# Altium project CtrlBox.PrjPcb
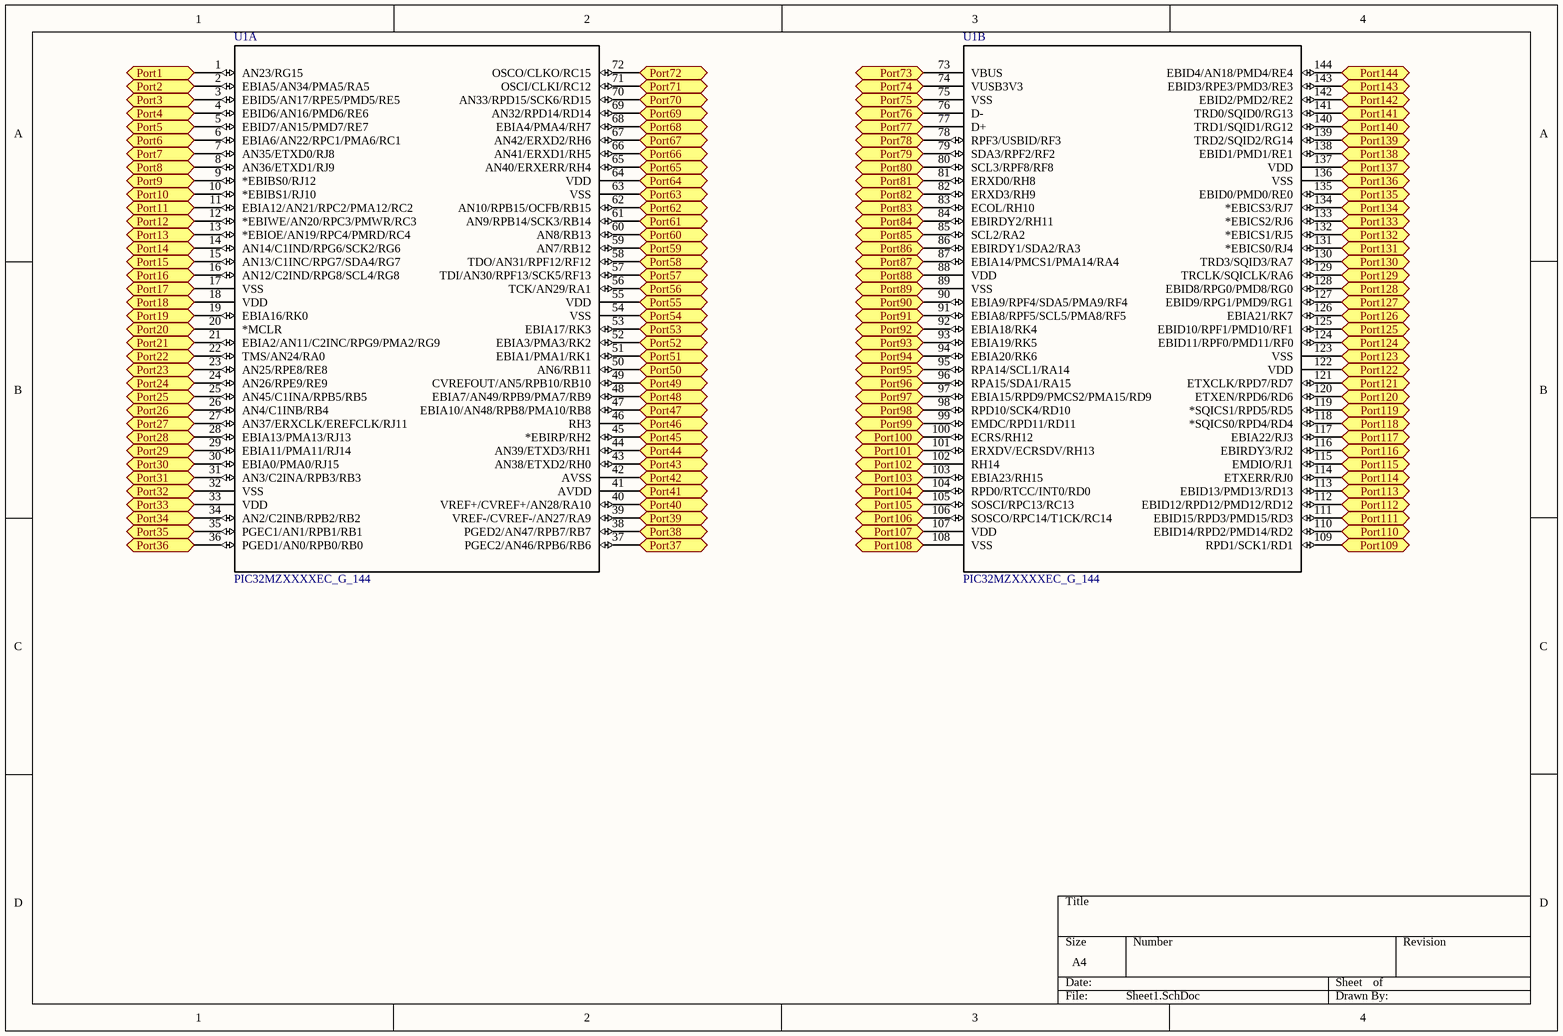
[diagram p0: Sheet1.SchDoc]
2 sheets, 31 parts. Net scope: flat (ports and power ports of the same name join across sheets).
Board file: PCB1.PcbDoc
Sheets:
  Sheet1.SchDoc
  Sheet2.SchDoc

## Sheet Sheet1.SchDoc
size A4

### Parts
U1  PIC32MZXXXXEC_G_144  [TQFP144_16X16MC]  (parts A,B of 2)

### Ports
Port1, Port2, Port3, Port4, Port5, Port6, Port7, Port8, Port9, Port10, Port11, Port12, Port13, Port14, Port15, Port16, Port17, Port18, Port19, Port20, Port21, Port22, Port23, Port24, Port25, Port26, Port27, Port28, Port29, Port30, Port31, Port32, Port33, Port34, Port35, Port36, Port37, Port38, Port39, Port40, Port41, Port42, Port43, Port44, Port45, Port46, Port47, Port48, Port49, Port50, Port51, Port52, Port53, Port54, Port55, Port56, Port57, Port58, Port59, Port60, Port61, Port62, Port63, Port64, Port65, Port66, Port67, Port68, Port69, Port70, Port71, Port72, Port73, Port74, Port75, Port76, Port77, Port78, Port79, Port80, Port81, Port82, Port83, Port84, Port85, Port86, Port87, Port88, Port89, Port90, Port91, Port92, Port93, Port94, Port95, Port96, Port97, Port98, Port99, Port100, Port101, Port102, Port103, Port104, Port105, Port106, Port107, Port108, Port109, Port110, Port111, Port112, Port113, Port114, Port115, Port116, Port117, Port118, Port119, Port120, Port121, Port122, Port123, Port124, Port125, Port126, Port127, Port128, Port129, Port130, Port131, Port132, Port133, Port134, Port135, Port136, Port137, Port138, Port139, Port140, Port141, Port142, Port143, Port144

### Nets
GND: U1.17(VSS) U1.32(VSS) U1.42(AVSS) U1.54(VSS) U1.63(VSS) U1.89(VSS) U1.108(VSS) U1.123(VSS) U1.136(VSS) ; port Port17, port Port32, port Port42, port Port54, port Port63, port Port89, port Port108, port Port123, port Port136
VCC: U1.18(VDD) U1.33(VDD) U1.41(AVDD) U1.55(VDD) U1.64(VDD) U1.88(VDD) U1.107(VDD) U1.122(VDD) U1.137(VDD) ; port Port18, port Port33, port Port41, port Port55, port Port64, port Port88, port Port107, port Port122, port Port137
NetP1_1: U1.1(AN23/RG15) ; port Port1
NetP1_2: U1.2(EBIA5/AN34/PMA5/RA5) ; port Port2
NetP1_3: U1.3(EBID5/AN17/RPE5/PMD5/RE5) ; port Port3
NetP1_4: U1.4(EBID6/AN16/PMD6/RE6) ; port Port4
NetP1_5: U1.5(EBID7/AN15/PMD7/RE7) ; port Port5
NetP1_6: U1.6(EBIA6/AN22/RPC1/PMA6/RC1) ; port Port6
NetP1_7: U1.7(AN35/ETXD0/RJ8) ; port Port7
NetP1_8: U1.8(AN36/ETXD1/RJ9) ; port Port8
NetP1_9: U1.9(*EBIBS0/RJ12) ; port Port9
NetP1_10: U1.10(*EBIBS1/RJ10) ; port Port10
NetP1_11: U1.11(EBIA12/AN21/RPC2/PMA12/RC2) ; port Port11
NetP1_12: U1.12(*EBIWE/AN20/RPC3/PMWR/RC3) ; port Port12
NetP1_13: U1.13(*EBIOE/AN19/RPC4/PMRD/RC4) ; port Port13
NetP1_14: U1.14(AN14/C1IND/RPG6/SCK2/RG6) ; port Port14
NetP1_15: U1.15(AN13/C1INC/RPG7/SDA4/RG7) ; port Port15
NetP1_16: U1.16(AN12/C2IND/RPG8/SCL4/RG8) ; port Port16
NetP1_19: U1.19(EBIA16/RK0) ; port Port19
NetP1_20: U1.20(*MCLR) ; port Port20
NetP1_21: U1.21(EBIA2/AN11/C2INC/RPG9/PMA2/RG9) ; port Port21
NetP1_22: U1.22(TMS/AN24/RA0) ; port Port22
NetP1_23: U1.23(AN25/RPE8/RE8) ; port Port23
NetP1_24: U1.24(AN26/RPE9/RE9) ; port Port24
NetP1_25: U1.25(AN45/C1INA/RPB5/RB5) ; port Port25
NetP1_26: U1.26(AN4/C1INB/RB4) ; port Port26
NetP1_27: U1.27(AN37/ERXCLK/EREFCLK/RJ11) ; port Port27
NetP1_28: U1.28(EBIA13/PMA13/RJ13) ; port Port28
NetP1_29: U1.29(EBIA11/PMA11/RJ14) ; port Port29
NetP1_30: U1.30(EBIA0/PMA0/RJ15) ; port Port30
NetP1_31: U1.31(AN3/C2INA/RPB3/RB3) ; port Port31
NetP1_34: U1.34(AN2/C2INB/RPB2/RB2) ; port Port34
NetP1_35: U1.35(PGEC1/AN1/RPB1/RB1) ; port Port35
NetP1_36: U1.36(PGED1/AN0/RPB0/RB0) ; port Port36
NetP2_1: U1.37(PGEC2/AN46/RPB6/RB6) ; port Port37
NetP2_2: U1.38(PGED2/AN47/RPB7/RB7) ; port Port38
NetP2_3: U1.39(VREF-/CVREF-/AN27/RA9) ; port Port39
NetP2_4: U1.40(VREF+/CVREF+/AN28/RA10) ; port Port40
NetP2_7: U1.43(AN38/ETXD2/RH0) ; port Port43
NetP2_8: U1.44(AN39/ETXD3/RH1) ; port Port44
NetP2_9: U1.45(*EBIRP/RH2) ; port Port45
NetP2_10: U1.46(RH3) ; port Port46
NetP2_11: U1.47(EBIA10/AN48/RPB8/PMA10/RB8) ; port Port47
NetP2_12: U1.48(EBIA7/AN49/RPB9/PMA7/RB9) ; port Port48
NetP2_13: U1.49(CVREFOUT/AN5/RPB10/RB10) ; port Port49
NetP2_14: U1.50(AN6/RB11) ; port Port50
NetP2_15: U1.51(EBIA1/PMA1/RK1) ; port Port51
NetP2_16: U1.52(EBIA3/PMA3/RK2) ; port Port52
NetP2_17: U1.53(EBIA17/RK3) ; port Port53
NetP2_20: U1.56(TCK/AN29/RA1) ; port Port56
NetP2_21: U1.57(TDI/AN30/RPF13/SCK5/RF13) ; port Port57
NetP2_22: U1.58(TDO/AN31/RPF12/RF12) ; port Port58
NetP2_23: U1.59(AN7/RB12) ; port Port59
NetP2_24: U1.60(AN8/RB13) ; port Port60
NetP2_25: U1.61(AN9/RPB14/SCK3/RB14) ; port Port61
NetP2_26: U1.62(AN10/RPB15/OCFB/RB15) ; port Port62
NetP2_29: U1.65(AN40/ERXERR/RH4) ; port Port65
NetP2_30: U1.66(AN41/ERXD1/RH5) ; port Port66
NetP2_31: U1.67(AN42/ERXD2/RH6) ; port Port67
NetP2_32: U1.68(EBIA4/PMA4/RH7) ; port Port68
NetP2_33: U1.69(AN32/RPD14/RD14) ; port Port69
NetP2_34: U1.70(AN33/RPD15/SCK6/RD15) ; port Port70
NetP2_35: U1.71(OSCI/CLKI/RC12) ; port Port71
NetP2_36: U1.72(OSCO/CLKO/RC15) ; port Port72
NetP3_1: U1.73(VBUS) ; port Port73
NetP3_2: U1.74(VUSB3V3) ; port Port74
NetP3_3: U1.75(VSS) ; port Port75
NetP3_4: U1.76(D-) ; port Port76
NetP3_5: U1.77(D+) ; port Port77
NetP3_6: U1.78(RPF3/USBID/RF3) ; port Port78
NetP3_7: U1.79(SDA3/RPF2/RF2) ; port Port79
NetP3_8: U1.80(SCL3/RPF8/RF8) ; port Port80
NetP3_9: U1.81(ERXD0/RH8) ; port Port81
NetP3_10: U1.82(ERXD3/RH9) ; port Port82
NetP3_11: U1.83(ECOL/RH10) ; port Port83
NetP3_12: U1.84(EBIRDY2/RH11) ; port Port84
NetP3_13: U1.85(SCL2/RA2) ; port Port85
NetP3_14: U1.86(EBIRDY1/SDA2/RA3) ; port Port86
NetP3_15: U1.87(EBIA14/PMCS1/PMA14/RA4) ; port Port87
NetP3_18: U1.90(EBIA9/RPF4/SDA5/PMA9/RF4) ; port Port90
NetP3_19: U1.91(EBIA8/RPF5/SCL5/PMA8/RF5) ; port Port91
NetP3_20: U1.92(EBIA18/RK4) ; port Port92
NetP3_21: U1.93(EBIA19/RK5) ; port Port93
NetP3_22: U1.94(EBIA20/RK6) ; port Port94
NetP3_23: U1.95(RPA14/SCL1/RA14) ; port Port95
NetP3_24: U1.96(RPA15/SDA1/RA15) ; port Port96
NetP3_25: U1.97(EBIA15/RPD9/PMCS2/PMA15/RD9) ; port Port97
NetP3_26: U1.98(RPD10/SCK4/RD10) ; port Port98
NetP3_27: U1.99(EMDC/RPD11/RD11) ; port Port99
NetP3_28: U1.100(ECRS/RH12) ; port Port100
NetP3_29: U1.101(ERXDV/ECRSDV/RH13) ; port Port101
NetP3_30: U1.102(RH14) ; port Port102
NetP3_31: U1.103(EBIA23/RH15) ; port Port103
NetP3_32: U1.104(RPD0/RTCC/INT0/RD0) ; port Port104
NetP3_33: U1.105(SOSCI/RPC13/RC13) ; port Port105
NetP3_34: U1.106(SOSCO/RPC14/T1CK/RC14) ; port Port106
NetP4_1: U1.109(RPD1/SCK1/RD1) ; port Port109
NetP4_2: U1.110(EBID14/RPD2/PMD14/RD2) ; port Port110
NetP4_3: U1.111(EBID15/RPD3/PMD15/RD3) ; port Port111
NetP4_4: U1.112(EBID12/RPD12/PMD12/RD12) ; port Port112
NetP4_5: U1.113(EBID13/PMD13/RD13) ; port Port113
NetP4_6: U1.114(ETXERR/RJ0) ; port Port114
NetP4_7: U1.115(EMDIO/RJ1) ; port Port115
NetP4_8: U1.116(EBIRDY3/RJ2) ; port Port116
NetP4_9: U1.117(EBIA22/RJ3) ; port Port117
NetP4_10: U1.118(*SQICS0/RPD4/RD4) ; port Port118
NetP4_11: U1.119(*SQICS1/RPD5/RD5) ; port Port119
NetP4_12: U1.120(ETXEN/RPD6/RD6) ; port Port120
NetP4_13: U1.121(ETXCLK/RPD7/RD7) ; port Port121
NetP4_16: U1.124(EBID11/RPF0/PMD11/RF0) ; port Port124
NetP4_17: U1.125(EBID10/RPF1/PMD10/RF1) ; port Port125
NetP4_18: U1.126(EBIA21/RK7) ; port Port126
NetP4_19: U1.127(EBID9/RPG1/PMD9/RG1) ; port Port127
NetP4_20: U1.128(EBID8/RPG0/PMD8/RG0) ; port Port128
NetP4_21: U1.129(TRCLK/SQICLK/RA6) ; port Port129
NetP4_22: U1.130(TRD3/SQID3/RA7) ; port Port130
NetP4_23: U1.131(*EBICS0/RJ4) ; port Port131
NetP4_24: U1.132(*EBICS1/RJ5) ; port Port132
NetP4_25: U1.133(*EBICS2/RJ6) ; port Port133
NetP4_26: U1.134(*EBICS3/RJ7) ; port Port134
NetP4_27: U1.135(EBID0/PMD0/RE0) ; port Port135
NetP4_30: U1.138(EBID1/PMD1/RE1) ; port Port138
NetP4_31: U1.139(TRD2/SQID2/RG14) ; port Port139
NetP4_32: U1.140(TRD1/SQID1/RG12) ; port Port140
NetP4_33: U1.141(TRD0/SQID0/RG13) ; port Port141
NetP4_34: U1.142(EBID2/PMD2/RE2) ; port Port142
NetP4_35: U1.143(EBID3/RPE3/PMD3/RE3) ; port Port143
NetP4_36: U1.144(EBID4/AN18/PMD4/RE4) ; port Port144

### Library data of the parts
U1 = PIC32MZXXXXEC_G_: Imported; Manufacturer_Part_Number: pic32mz2048ech144-i/ph; Vendor: Microchip; RefDes: RefDes; Type: Type; Value: Value

## Sheet Sheet2.SchDoc
size A4
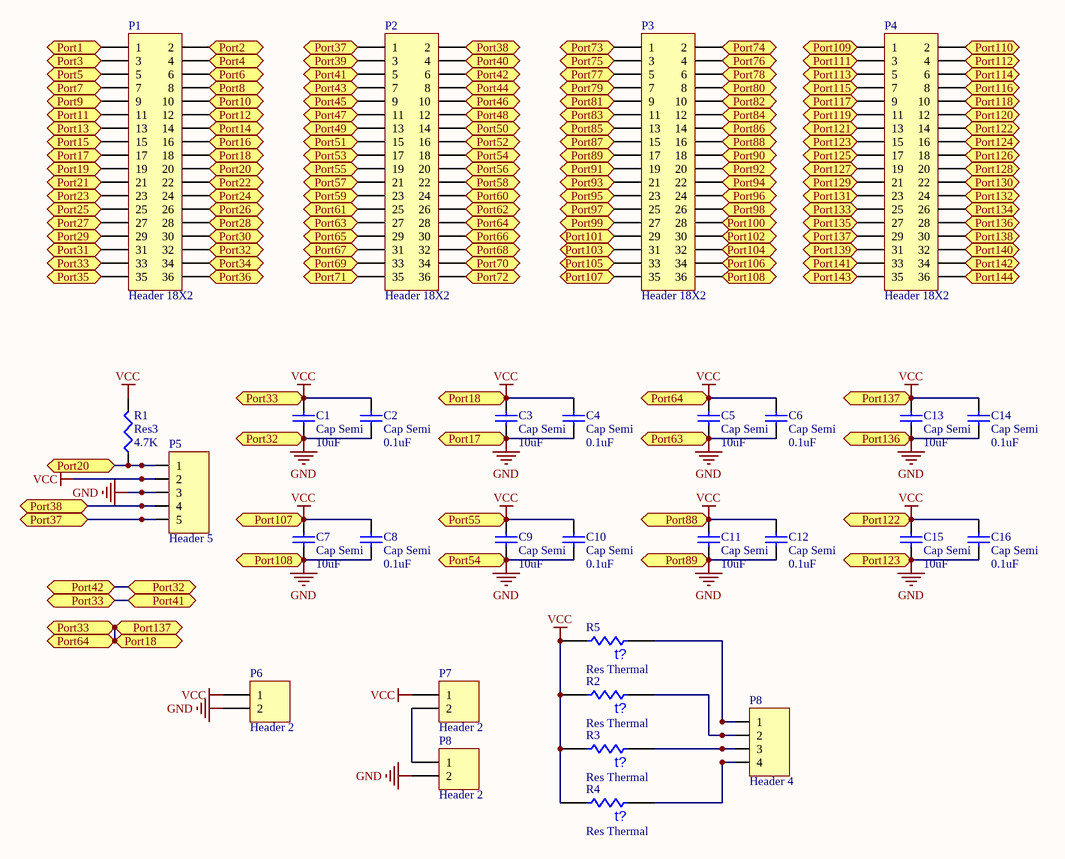
[diagram p1: Sheet2.SchDoc]

### Parts
(Parts that share a designator on the sheet are numbered #1, #2 ... from top to bottom, then left to right.)
C1  Cap Semi  value 10uF  [1608[0603]]
C2  Cap Semi  value 0.1uF  [1608[0603]]
C3  Cap Semi  value 10uF  [1608[0603]]
C4  Cap Semi  value 0.1uF  [1608[0603]]
C5  Cap Semi  value 10uF  [1608[0603]]
C6  Cap Semi  value 0.1uF  [1608[0603]]
C7  Cap Semi  value 10uF  [1608[0603]]
C8  Cap Semi  value 0.1uF  [1608[0603]]
C9  Cap Semi  value 10uF  [1608[0603]]
C10  Cap Semi  value 0.1uF  [1608[0603]]
C11  Cap Semi  value 10uF  [1608[0603]]
C12  Cap Semi  value 0.1uF  [1608[0603]]
C13  Cap Semi  value 10uF  [1608[0603]]
C14  Cap Semi  value 0.1uF  [1608[0603]]
C15  Cap Semi  value 10uF  [1608[0603]]
C16  Cap Semi  value 0.1uF  [1608[0603]]
P1  Header 18X2  [HDR2X18]
P2  Header 18X2  [HDR2X18]
P3  Header 18X2  [HDR2X18]
P4  Header 18X2  [HDR2X18]
P5  Header 5  [HDR1X5]
P6  Header 2  [HDR1X2]
P7  Header 2  [HDR1X2]
P8#1  Header 4  [HDR1X4]
P8#2  Header 2  [HDR1X2]
R1  Res3  value 4.7K  [J1-0603]
R2  Res Thermal  [6-0805_N]
R3  Res Thermal  [6-0805_N]
R4  Res Thermal  [6-0805_N]
R5  Res Thermal  [6-0805_N]

### Ports
Port1, Port2, Port3, Port4, Port5, Port6, Port7, Port8, Port9, Port10, Port11, Port12, Port13, Port14, Port15, Port16, Port17, Port18, Port19, Port20, Port21, Port22, Port23, Port24, Port25, Port26, Port27, Port28, Port29, Port30, Port31, Port32, Port33, Port34, Port35, Port36, Port37, Port38, Port39, Port40, Port41, Port42, Port43, Port44, Port45, Port46, Port47, Port48, Port49, Port50, Port51, Port52, Port53, Port54, Port55, Port56, Port57, Port58, Port59, Port60, Port61, Port62, Port63, Port64, Port65, Port66, Port67, Port68, Port69, Port70, Port71, Port72, Port73, Port74, Port75, Port76, Port77, Port78, Port79, Port80, Port81, Port82, Port83, Port84, Port85, Port86, Port87, Port88, Port89, Port90, Port91, Port92, Port93, Port94, Port95, Port96, Port97, Port98, Port99, Port100, Port101, Port102, Port103, Port104, Port105, Port106, Port107, Port108, Port109, Port110, Port111, Port112, Port113, Port114, Port115, Port116, Port117, Port118, Port119, Port120, Port121, Port122, Port123, Port124, Port125, Port126, Port127, Port128, Port129, Port130, Port131, Port132, Port133, Port134, Port135, Port136, Port137, Port138, Port139, Port140, Port141, Port142, Port143, Port144

### Nets
GND: C1.1 C2.1 C3.1 C4.1 C5.1 C6.1 C7.1 C8.1 C9.1 C10.1 C11.1 C12.1 C13.1 C14.1 C15.1 C16.1 P1.17 P1.32 P2.6 P2.18 P2.27 P3.17 P3.36 P4.15 P4.28 P5.3 P6.2 P8#2.2 ; port Port17, port Port32, port Port42, port Port54, port Port63, port Port89, port Port108, port Port123, port Port136
VCC: C1.2 C2.2 C3.2 C4.2 C5.2 C6.2 C7.2 C8.2 C9.2 C10.2 C11.2 C12.2 C13.2 C14.2 C15.2 C16.2 P1.18 P1.33 P2.5 P2.19 P2.28 P3.16 P3.35 P4.14 P4.29 P5.2 P6.1 P7.1 R1.2 R2.2 R3.2 R4.2 R5.2 ; port Port18, port Port33, port Port41, port Port55, port Port64, port Port88, port Port107, port Port122, port Port137
NetP1_1: P1.1 ; port Port1
NetP1_2: P1.2 ; port Port2
NetP1_3: P1.3 ; port Port3
NetP1_4: P1.4 ; port Port4
NetP1_5: P1.5 ; port Port5
NetP1_6: P1.6 ; port Port6
NetP1_7: P1.7 ; port Port7
NetP1_8: P1.8 ; port Port8
NetP1_9: P1.9 ; port Port9
NetP1_10: P1.10 ; port Port10
NetP1_11: P1.11 ; port Port11
NetP1_12: P1.12 ; port Port12
NetP1_13: P1.13 ; port Port13
NetP1_14: P1.14 ; port Port14
NetP1_15: P1.15 ; port Port15
NetP1_16: P1.16 ; port Port16
NetP1_19: P1.19 ; port Port19
NetP1_20: P1.20 P5.1 R1.1 ; port Port20
NetP1_21: P1.21 ; port Port21
NetP1_22: P1.22 ; port Port22
NetP1_23: P1.23 ; port Port23
NetP1_24: P1.24 ; port Port24
NetP1_25: P1.25 ; port Port25
NetP1_26: P1.26 ; port Port26
NetP1_27: P1.27 ; port Port27
NetP1_28: P1.28 ; port Port28
NetP1_29: P1.29 ; port Port29
NetP1_30: P1.30 ; port Port30
NetP1_31: P1.31 ; port Port31
NetP1_34: P1.34 ; port Port34
NetP1_35: P1.35 ; port Port35
NetP1_36: P1.36 ; port Port36
NetP2_1: P2.1 P5.5 ; port Port37
NetP2_2: P2.2 P5.4 ; port Port38
NetP2_3: P2.3 ; port Port39
NetP2_4: P2.4 ; port Port40
NetP2_7: P2.7 ; port Port43
NetP2_8: P2.8 ; port Port44
NetP2_9: P2.9 ; port Port45
NetP2_10: P2.10 ; port Port46
NetP2_11: P2.11 ; port Port47
NetP2_12: P2.12 ; port Port48
NetP2_13: P2.13 ; port Port49
NetP2_14: P2.14 ; port Port50
NetP2_15: P2.15 ; port Port51
NetP2_16: P2.16 ; port Port52
NetP2_17: P2.17 ; port Port53
NetP2_20: P2.20 ; port Port56
NetP2_21: P2.21 ; port Port57
NetP2_22: P2.22 ; port Port58
NetP2_23: P2.23 ; port Port59
NetP2_24: P2.24 ; port Port60
NetP2_25: P2.25 ; port Port61
NetP2_26: P2.26 ; port Port62
NetP2_29: P2.29 ; port Port65
NetP2_30: P2.30 ; port Port66
NetP2_31: P2.31 ; port Port67
NetP2_32: P2.32 ; port Port68
NetP2_33: P2.33 ; port Port69
NetP2_34: P2.34 ; port Port70
NetP2_35: P2.35 ; port Port71
NetP2_36: P2.36 ; port Port72
NetP3_1: P3.1 ; port Port73
NetP3_2: P3.2 ; port Port74
NetP3_3: P3.3 ; port Port75
NetP3_4: P3.4 ; port Port76
NetP3_5: P3.5 ; port Port77
NetP3_6: P3.6 ; port Port78
NetP3_7: P3.7 ; port Port79
NetP3_8: P3.8 ; port Port80
NetP3_9: P3.9 ; port Port81
NetP3_10: P3.10 ; port Port82
NetP3_11: P3.11 ; port Port83
NetP3_12: P3.12 ; port Port84
NetP3_13: P3.13 ; port Port85
NetP3_14: P3.14 ; port Port86
NetP3_15: P3.15 ; port Port87
NetP3_18: P3.18 ; port Port90
NetP3_19: P3.19 ; port Port91
NetP3_20: P3.20 ; port Port92
NetP3_21: P3.21 ; port Port93
NetP3_22: P3.22 ; port Port94
NetP3_23: P3.23 ; port Port95
NetP3_24: P3.24 ; port Port96
NetP3_25: P3.25 ; port Port97
NetP3_26: P3.26 ; port Port98
NetP3_27: P3.27 ; port Port99
NetP3_28: P3.28 ; port Port100
NetP3_29: P3.29 ; port Port101
NetP3_30: P3.30 ; port Port102
NetP3_31: P3.31 ; port Port103
NetP3_32: P3.32 ; port Port104
NetP3_33: P3.33 ; port Port105
NetP3_34: P3.34 ; port Port106
NetP4_1: P4.1 ; port Port109
NetP4_2: P4.2 ; port Port110
NetP4_3: P4.3 ; port Port111
NetP4_4: P4.4 ; port Port112
NetP4_5: P4.5 ; port Port113
NetP4_6: P4.6 ; port Port114
NetP4_7: P4.7 ; port Port115
NetP4_8: P4.8 ; port Port116
NetP4_9: P4.9 ; port Port117
NetP4_10: P4.10 ; port Port118
NetP4_11: P4.11 ; port Port119
NetP4_12: P4.12 ; port Port120
NetP4_13: P4.13 ; port Port121
NetP4_16: P4.16 ; port Port124
NetP4_17: P4.17 ; port Port125
NetP4_18: P4.18 ; port Port126
NetP4_19: P4.19 ; port Port127
NetP4_20: P4.20 ; port Port128
NetP4_21: P4.21 ; port Port129
NetP4_22: P4.22 ; port Port130
NetP4_23: P4.23 ; port Port131
NetP4_24: P4.24 ; port Port132
NetP4_25: P4.25 ; port Port133
NetP4_26: P4.26 ; port Port134
NetP4_27: P4.27 ; port Port135
NetP4_30: P4.30 ; port Port138
NetP4_31: P4.31 ; port Port139
NetP4_32: P4.32 ; port Port140
NetP4_33: P4.33 ; port Port141
NetP4_34: P4.34 ; port Port142
NetP4_35: P4.35 ; port Port143
NetP4_36: P4.36 ; port Port144
NetP7_2: P7.2 P8#2.1
NetP8#1_1: P8#1.1 R5.1
NetP8#1_2: P8#1.2 R2.1
NetP8#1_3: P8#1.3 R3.1
NetP8#1_4: P8#1.4 R4.1

### Notes on the sheet
- (in symbol Res Thermal) t?

### Library data of the parts
C1-C16 = Cap Semi: Capacitor (Semiconductor SIM Model); Published: 8-Jun-2000; LatestRevisionDate: 29-May-2009; LatestRevisionNote: IPC-7351 Footprint Added.; PackageReference: C1206; Publisher: Altium Limited; PackageDescription: Chip Capacitor
P1-P4 = Header 18X2: Header, 18-Pin, Dual row; LatestRevisionDate: 17-Jul-2002; LatestRevisionNote: Re-released for DXP Platform.; Publisher: Altium Limited
P5 = Header 5: Header, 5-Pin; LatestRevisionDate: 17-Jul-2002; LatestRevisionNote: Re-released for DXP Platform.; Publisher: Altium Limited
P6 P7 P8#2 = Header 2: Header, 2-Pin; LatestRevisionDate: 17-Jul-2002; LatestRevisionNote: Re-released for DXP Platform.; Publisher: Altium Limited
P8#1 = Header 4: Header, 4-Pin; LatestRevisionDate: 17-Jul-2002; LatestRevisionNote: Re-released for DXP Platform.; Publisher: Altium Limited
R1 = Res3: Resistor; Published: 8-Jun-2000; LatestRevisionDate: 29-May-2009; LatestRevisionNote: IPC-7351 Footprint Added.; PackageReference: J1-0603; Publisher: Altium Limited; PackageDescription: Chip Resistor
R2-R5 = Res Thermal: Thermistor; Published: 24-Mar-1999; LatestRevisionDate: 29-May-2009; LatestRevisionNote: IPC-7351 Footprint Added.; PackageVersion: Mar-2003; PackageReference: 6-0805; Publisher: Altium Limited; PackageDescription: Chip Resistor 0805 Case Size; Code_IPC: RESC2012

## Nets that join several sheets
GND: Sheet1 (9 pins), Sheet2 (28 pins)
VCC: Sheet1 (9 pins), Sheet2 (33 pins)
NetP1_1: Sheet1 (U1.1), Sheet2 (P1.1)
NetP1_2: Sheet1 (U1.2), Sheet2 (P1.2)
NetP1_3: Sheet1 (U1.3), Sheet2 (P1.3)
NetP1_4: Sheet1 (U1.4), Sheet2 (P1.4)
NetP1_5: Sheet1 (U1.5), Sheet2 (P1.5)
NetP1_6: Sheet1 (U1.6), Sheet2 (P1.6)
NetP1_7: Sheet1 (U1.7), Sheet2 (P1.7)
NetP1_8: Sheet1 (U1.8), Sheet2 (P1.8)
NetP1_9: Sheet1 (U1.9), Sheet2 (P1.9)
NetP1_10: Sheet1 (U1.10), Sheet2 (P1.10)
NetP1_11: Sheet1 (U1.11), Sheet2 (P1.11)
NetP1_12: Sheet1 (U1.12), Sheet2 (P1.12)
NetP1_13: Sheet1 (U1.13), Sheet2 (P1.13)
NetP1_14: Sheet1 (U1.14), Sheet2 (P1.14)
NetP1_15: Sheet1 (U1.15), Sheet2 (P1.15)
NetP1_16: Sheet1 (U1.16), Sheet2 (P1.16)
NetP1_19: Sheet1 (U1.19), Sheet2 (P1.19)
NetP1_20: Sheet1 (U1.20), Sheet2 (P1.20 P5.1 R1.1)
NetP1_21: Sheet1 (U1.21), Sheet2 (P1.21)
NetP1_22: Sheet1 (U1.22), Sheet2 (P1.22)
NetP1_23: Sheet1 (U1.23), Sheet2 (P1.23)
NetP1_24: Sheet1 (U1.24), Sheet2 (P1.24)
NetP1_25: Sheet1 (U1.25), Sheet2 (P1.25)
NetP1_26: Sheet1 (U1.26), Sheet2 (P1.26)
NetP1_27: Sheet1 (U1.27), Sheet2 (P1.27)
NetP1_28: Sheet1 (U1.28), Sheet2 (P1.28)
NetP1_29: Sheet1 (U1.29), Sheet2 (P1.29)
NetP1_30: Sheet1 (U1.30), Sheet2 (P1.30)
NetP1_31: Sheet1 (U1.31), Sheet2 (P1.31)
NetP1_34: Sheet1 (U1.34), Sheet2 (P1.34)
NetP1_35: Sheet1 (U1.35), Sheet2 (P1.35)
NetP1_36: Sheet1 (U1.36), Sheet2 (P1.36)
NetP2_1: Sheet1 (U1.37), Sheet2 (P2.1 P5.5)
NetP2_2: Sheet1 (U1.38), Sheet2 (P2.2 P5.4)
NetP2_3: Sheet1 (U1.39), Sheet2 (P2.3)
NetP2_4: Sheet1 (U1.40), Sheet2 (P2.4)
NetP2_7: Sheet1 (U1.43), Sheet2 (P2.7)
NetP2_8: Sheet1 (U1.44), Sheet2 (P2.8)
NetP2_9: Sheet1 (U1.45), Sheet2 (P2.9)
NetP2_10: Sheet1 (U1.46), Sheet2 (P2.10)
NetP2_11: Sheet1 (U1.47), Sheet2 (P2.11)
NetP2_12: Sheet1 (U1.48), Sheet2 (P2.12)
NetP2_13: Sheet1 (U1.49), Sheet2 (P2.13)
NetP2_14: Sheet1 (U1.50), Sheet2 (P2.14)
NetP2_15: Sheet1 (U1.51), Sheet2 (P2.15)
NetP2_16: Sheet1 (U1.52), Sheet2 (P2.16)
NetP2_17: Sheet1 (U1.53), Sheet2 (P2.17)
NetP2_20: Sheet1 (U1.56), Sheet2 (P2.20)
NetP2_21: Sheet1 (U1.57), Sheet2 (P2.21)
NetP2_22: Sheet1 (U1.58), Sheet2 (P2.22)
NetP2_23: Sheet1 (U1.59), Sheet2 (P2.23)
NetP2_24: Sheet1 (U1.60), Sheet2 (P2.24)
NetP2_25: Sheet1 (U1.61), Sheet2 (P2.25)
NetP2_26: Sheet1 (U1.62), Sheet2 (P2.26)
NetP2_29: Sheet1 (U1.65), Sheet2 (P2.29)
NetP2_30: Sheet1 (U1.66), Sheet2 (P2.30)
NetP2_31: Sheet1 (U1.67), Sheet2 (P2.31)
NetP2_32: Sheet1 (U1.68), Sheet2 (P2.32)
NetP2_33: Sheet1 (U1.69), Sheet2 (P2.33)
NetP2_34: Sheet1 (U1.70), Sheet2 (P2.34)
NetP2_35: Sheet1 (U1.71), Sheet2 (P2.35)
NetP2_36: Sheet1 (U1.72), Sheet2 (P2.36)
NetP3_1: Sheet1 (U1.73), Sheet2 (P3.1)
NetP3_2: Sheet1 (U1.74), Sheet2 (P3.2)
NetP3_3: Sheet1 (U1.75), Sheet2 (P3.3)
NetP3_4: Sheet1 (U1.76), Sheet2 (P3.4)
NetP3_5: Sheet1 (U1.77), Sheet2 (P3.5)
NetP3_6: Sheet1 (U1.78), Sheet2 (P3.6)
NetP3_7: Sheet1 (U1.79), Sheet2 (P3.7)
NetP3_8: Sheet1 (U1.80), Sheet2 (P3.8)
NetP3_9: Sheet1 (U1.81), Sheet2 (P3.9)
NetP3_10: Sheet1 (U1.82), Sheet2 (P3.10)
NetP3_11: Sheet1 (U1.83), Sheet2 (P3.11)
NetP3_12: Sheet1 (U1.84), Sheet2 (P3.12)
NetP3_13: Sheet1 (U1.85), Sheet2 (P3.13)
NetP3_14: Sheet1 (U1.86), Sheet2 (P3.14)
NetP3_15: Sheet1 (U1.87), Sheet2 (P3.15)
NetP3_18: Sheet1 (U1.90), Sheet2 (P3.18)
NetP3_19: Sheet1 (U1.91), Sheet2 (P3.19)
NetP3_20: Sheet1 (U1.92), Sheet2 (P3.20)
NetP3_21: Sheet1 (U1.93), Sheet2 (P3.21)
NetP3_22: Sheet1 (U1.94), Sheet2 (P3.22)
NetP3_23: Sheet1 (U1.95), Sheet2 (P3.23)
NetP3_24: Sheet1 (U1.96), Sheet2 (P3.24)
NetP3_25: Sheet1 (U1.97), Sheet2 (P3.25)
NetP3_26: Sheet1 (U1.98), Sheet2 (P3.26)
NetP3_27: Sheet1 (U1.99), Sheet2 (P3.27)
NetP3_28: Sheet1 (U1.100), Sheet2 (P3.28)
NetP3_29: Sheet1 (U1.101), Sheet2 (P3.29)
NetP3_30: Sheet1 (U1.102), Sheet2 (P3.30)
NetP3_31: Sheet1 (U1.103), Sheet2 (P3.31)
NetP3_32: Sheet1 (U1.104), Sheet2 (P3.32)
NetP3_33: Sheet1 (U1.105), Sheet2 (P3.33)
NetP3_34: Sheet1 (U1.106), Sheet2 (P3.34)
NetP4_1: Sheet1 (U1.109), Sheet2 (P4.1)
NetP4_2: Sheet1 (U1.110), Sheet2 (P4.2)
NetP4_3: Sheet1 (U1.111), Sheet2 (P4.3)
NetP4_4: Sheet1 (U1.112), Sheet2 (P4.4)
NetP4_5: Sheet1 (U1.113), Sheet2 (P4.5)
NetP4_6: Sheet1 (U1.114), Sheet2 (P4.6)
NetP4_7: Sheet1 (U1.115), Sheet2 (P4.7)
NetP4_8: Sheet1 (U1.116), Sheet2 (P4.8)
NetP4_9: Sheet1 (U1.117), Sheet2 (P4.9)
NetP4_10: Sheet1 (U1.118), Sheet2 (P4.10)
NetP4_11: Sheet1 (U1.119), Sheet2 (P4.11)
NetP4_12: Sheet1 (U1.120), Sheet2 (P4.12)
NetP4_13: Sheet1 (U1.121), Sheet2 (P4.13)
NetP4_16: Sheet1 (U1.124), Sheet2 (P4.16)
NetP4_17: Sheet1 (U1.125), Sheet2 (P4.17)
NetP4_18: Sheet1 (U1.126), Sheet2 (P4.18)
NetP4_19: Sheet1 (U1.127), Sheet2 (P4.19)
NetP4_20: Sheet1 (U1.128), Sheet2 (P4.20)
NetP4_21: Sheet1 (U1.129), Sheet2 (P4.21)
NetP4_22: Sheet1 (U1.130), Sheet2 (P4.22)
NetP4_23: Sheet1 (U1.131), Sheet2 (P4.23)
NetP4_24: Sheet1 (U1.132), Sheet2 (P4.24)
NetP4_25: Sheet1 (U1.133), Sheet2 (P4.25)
NetP4_26: Sheet1 (U1.134), Sheet2 (P4.26)
NetP4_27: Sheet1 (U1.135), Sheet2 (P4.27)
NetP4_30: Sheet1 (U1.138), Sheet2 (P4.30)
NetP4_31: Sheet1 (U1.139), Sheet2 (P4.31)
NetP4_32: Sheet1 (U1.140), Sheet2 (P4.32)
NetP4_33: Sheet1 (U1.141), Sheet2 (P4.33)
NetP4_34: Sheet1 (U1.142), Sheet2 (P4.34)
NetP4_35: Sheet1 (U1.143), Sheet2 (P4.35)
NetP4_36: Sheet1 (U1.144), Sheet2 (P4.36)